# EasyEDA schematic Schematic_EasyEDA_Half Cat GSE Controller_2025-02-08.json
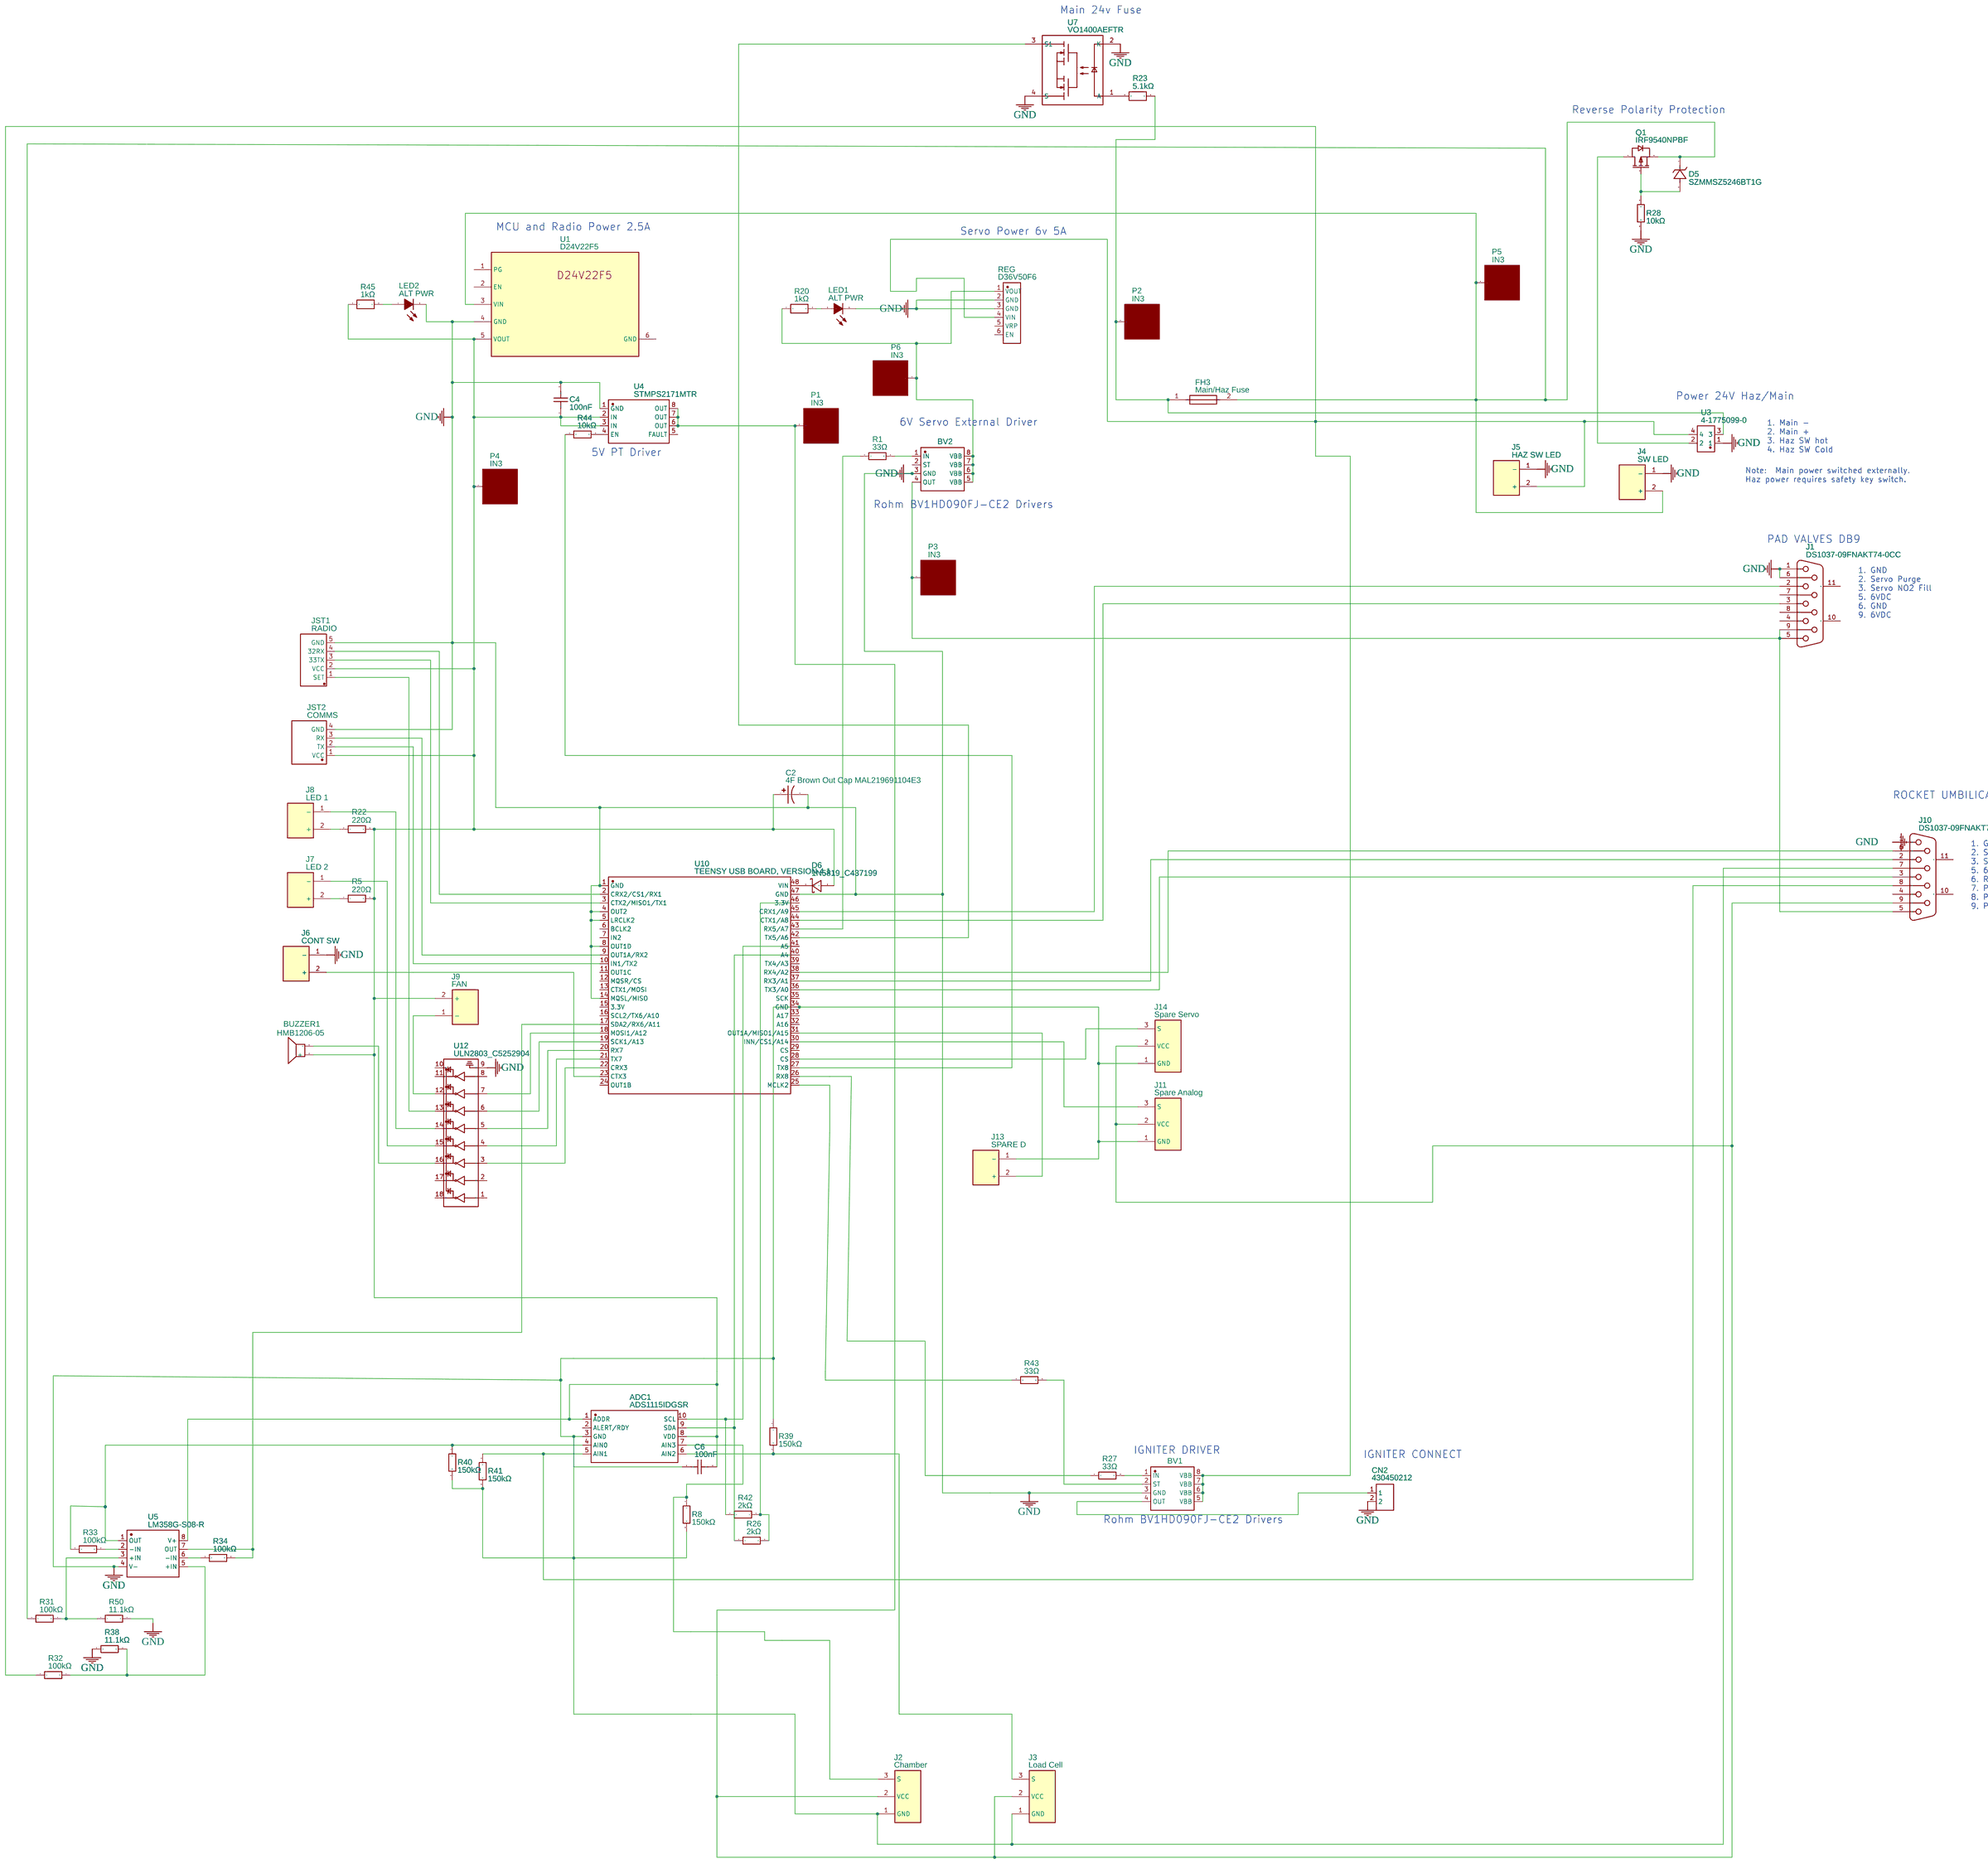
[diagram p0: schematic sheet]

## Parts
ADC1  ADS1115IDGSR  [MSOP-10_L3.0-W3.0-P0.50-LS5.0-BL]
BUZZER1  HMB1206-05  [BUZ-TH_BD12.0-P7.60-D0.6-FD]
BV1  BV2  [SOP-8_L4.9-W3.9-P1.27-LS6.0-BL]
BV2  BV1  [SOP-8_L4.9-W3.9-P1.27-LS6.0-BL]
C2  4F Brown Out Cap MAL219691104E3  [CAP_ROUND_7.5MM]
C4  100nF  [C0402]
C6  100nF  [C0402]
CN2  430450212  [CONN-TH_430450212]
D5  SZMMSZ5246BT1G  [SOD-123_L2.7-W1.6-LS3.7-RD-1]
D6  1N5819_C437199  [SMA_L4.4-W2.6-LS5.0-RD]
FH3  Main/Haz Fuse  [LITTLEFUSE 01000063Z]
J1  DS1037-09FNAKT74-0CC  [DSUB-TH_DS1037-09FNAKT74-0CC]
J2  Chamber  [PH-3A]
J3  Load Cell  [PH-3A]
J4  SW LED  [CONN-TH_B2B-PH-K-S]
J5  HAZ SW LED  [CONN-TH_B2B-PH-K-S]
J6  CONT SW  [CONN-TH_B2B-PH-K-S]
J7  LED 2  [CONN-TH_B2B-PH-K-S]
J8  LED 1  [CONN-TH_B2B-PH-K-S]
J9  FAN  [CONN-TH_B2B-PH-K-S]
J10  DS1037-09FNAKT74-0CC  [DSUB-TH_DS1037-09FNAKT74-0CC]
J11  Spare Analog  [PH-3A]
J13  SPARE D  [CONN-TH_B2B-PH-K-S]
J14  Spare Servo  [PH-3A]
JST1  RADIO  [CONN-TH_B5B-PH-K-S-LF-SN]
JST2  COMMS  [CONN-TH_B4B-PH-K-LF-SN]
LED1  ALT PWR  [LED-SMD_L3.5-W2.8-R-RD]
LED2  ALT PWR  [LED-SMD_L3.5-W2.8-R-RD]
P1  IN3  [PAD_1.5X2.5]
P2  IN3  [PAD_1.5X2.5]
P3  IN3  [PAD_1.5X2.5]
P4  IN3  [PAD_1.5X2.5]
P5  IN3  [PAD_1.5X2.5]
P6  IN3  [PAD_1.5X2.5]
Q1  IRF9540NPBF  [TO-220-3_L10.0-W4.5-P2.54-L]
R1  33Ω  [R0603]
R5  220Ω  [R0805]
R8  150kΩ  [R0805]
R20  1kΩ  [R0805]
R22  220Ω  [R0805]
R23  5.1kΩ  [R0805]
R26  2kΩ  [R0805]
R27  33Ω  [R0603]
R28  10kΩ  [R0805]
R31  100kΩ  [R0805]
R32  100kΩ  [R0805]
R33  100kΩ  [R0805]
R34  100kΩ  [R0805]
R38  11.1kΩ  [R0603]
R39  150kΩ  [R0805]
R40  150kΩ  [R0805]
R41  150kΩ  [R0805]
R42  2kΩ  [R0805]
R43  33Ω  [R0603]
R44  10kΩ  [R0805]
R45  1kΩ  [R0805]
R50  11.1kΩ  [R0603]
REG  D36V50F6  [D36V50F6]
U1  D24V22F5  [D24V22F5]
U3  4-1775099-0  [CONN-TH_4P-P4.20_TE_4-1775099-0]
U4  STMPS2171MTR  [SO-8_L4.9-W3.9-P1.27-LS6.0-BL]
U5  LM358G-S08-R  [SOIC-8_L5.0-W4.0-P1.27-LS6.0-BL]
U7  VO1400AEFTR  [SOP-4_L4.6-W4.4-P2.54-LS7.0-TL]
U10  TEENSY USB BOARD, VERSION 4.1  [COMM-TH_L61.0-W17.8-P2.54]
U12  ULN2803_C5252904  [SOP-18_L11.5-W7.5-P1.27-LS10.3-BL]

## Library data of the parts
ADC1 = ADS1115IDGSR: Supplier: LCSC; Manufacturer: TI(德州仪器); Supplier Part: C37593; JLCPCB Part Class: Extended Part; link: https://lcsc.com/eda_search?q=C37593&%26type=1&ref=editor
BUZZER1 = HMB1206-05: Supplier: LCSC; Manufacturer: HNDZ; Supplier Part: C96095; LCSC Assembly: Yes; SMT Type: Extend; Assembly Type: manualWeld; Paste Type: expand
BV1 BV2 = BV1HD090FJ-CE2: Supplier: LCSC; Supplier Part: C2150182; Manufacturer: ROHM(罗姆); Contributor: LCSC; JLCPCB Part Class: Extended Part
C2 = C_Tan_SMD_A_US: Contributor: LCEDA_Lib
C4 C6 = GRM155B31C104KA87D: Supplier: LCSC; Manufacturer: muRata(村田); Supplier Part: C85951; JLCPCB Part Class: Extended Part; link: https://lcsc.com/eda_search?q=C85951&%26type=1&ref=editor
CN2 = 430450212: Contributor: LCSC; Supplier: LCSC; Supplier Part: C293362; Manufacturer: MOLEX; JLCPCB Part Class: Extended Part; link: https://lcsc.com/eda_search?q=C293362&%26type=1&ref=editor
D5 = SZMMSZ5246BT1G: Contributor: LCSC; Supplier: LCSC; Supplier Part: C513075; Manufacturer: onsemi(安森美); JLCPCB Part Class: Extended Part; link: https://lcsc.com/eda_search?q=C513075&%26type=1&ref=editor
D6 = 1N5819_C437199: Contributor: LCSC; Supplier: LCSC; Supplier Part: C437199; Manufacturer: KEXIN(科信); Manufacturer Part: 1N5819; JLCPCB Part Class: Extended Part; link: https://lcsc.com/eda_search?q=C437199&%26type=1&ref=editor
FH3 = Mini Blade Fuse Holder: Supplier: LCSC; Supplier Part: 01000063Z; Manufacturer: Littlefuse; Manufacturer Part: 01000063Z; Contributor: Bob11746; JLCPCB Part Class: Extended Part
J1 J10 = DS1037-09FNAKT74-0CC: Supplier: LCSC; Manufacturer: CONNFLY; Supplier Part: C75749; JLCPCB Part Class: Extended Part
J2 J3 J11 J14 = -: Supplier: LCSC; Manufacturer: JST; Manufacturer Part: B3B-PH-K-S(LF)(SN); Contributor: LCSC; Supplier Part: C131339
J4-J9 J13 = B2B-PH-K-S(LF)(SN): Supplier: LCSC; Manufacturer: JST; Contributor: LCSC; Supplier Part: C131337
JST1 = B5B-PH-K-S-(LF)(SN): Contributor: LCSC; Supplier: LCSC; Supplier Part: C157993; Manufacturer: JST; Manufacturer Part: B5B-PH-K-S(LF)(SN); JLCPCB Part Class: Extended Part; link: https://lcsc.com/eda_search?q=C157993&%26type=1&ref=editor
JST2 = B4B-PH-K(LF)(SN): Contributor: LCSC; Supplier: LCSC; Supplier Part: C265289; Manufacturer: JST; JLCPCB Part Class: Extended Part; link: https://lcsc.com/eda_search?q=C265289&%26type=1&ref=editor
LED1 LED2 = 67-21/R6C-FN2Q1BZ/2T: Supplier: LCSC; Manufacturer: EVERLIGHT; image: //image.lceda.cn/szlcsc/C74350.jpg; Supplier Part: C74350; SMT Type: Extend; JLCPCB SMD: Yes; LCSC Assembly: Yes; Paste Type: expand
P1-P6 = Solder Pad: Manufacturer Part: Soldering pad; Supplier Part: undefined; Contributor: Michael Gronlund
Q1 = IRF9540NPBF: Supplier: LCSC; Manufacturer: Infineon(英飞凌); Supplier Part: C2575; JLCPCB Part Class: Extended Part; link: https://lcsc.com/eda_search?q=C2575&%26type=1&ref=editor
R1 R27 R43 = RM06FTN33R0: Contributor: LCSC; Supplier: LCSC; Supplier Part: C188015; Manufacturer: 大毅科技; JLCPCB Part Class: Extended Part; link: https://lcsc.com/eda_search?q=C188015&%26type=1&ref=editor
R5 R22 = MCWR08X221-JTL: Contributor: LCSC; Supplier: LCSC; Supplier Part: C243171; Manufacturer: Multicomp; Manufacturer Part: MCWR08X221 JTL; JLCPCB Part Class: Extended Part; link: https://lcsc.com/eda_search?q=C243171&%26type=1&ref=editor
R8 R39-R41 = RK73B2ATTD154J: Contributor: LCSC; Supplier: LCSC; Supplier Part: C276119; Manufacturer: KOA; JLCPCB Part Class: Extended Part; link: https://lcsc.com/eda_search?q=C276119&%26type=1&ref=editor
R20 R45 = TC0550F1001T5J: Contributor: LCSC; Supplier: LCSC; Supplier Part: C517536; Manufacturer: UNI-ROYAL(厚声); JLCPCB Part Class: Extended Part; link: https://lcsc.com/eda_search?q=C517536&%26type=1&ref=editor
R23 = SCR0805F5K1: Contributor: lcsc; Supplier: LCSC; Supplier Part: C3016714; Manufacturer: VO(翔胜); JLCPCB Part Class: Extended Part; link: https://lcsc.com/eda_search?q=C3016714&%26type=1&ref=editor
R26 R42 = RC0805DR-072KL: Contributor: LCSC; Supplier: LCSC; Manufacturer: YAGEO(国巨); Supplier Part: C164147; JLCPCB Part Class: Extended Part; link: https://lcsc.com/eda_search?q=C164147&%26type=1&ref=editor
R28 R44 = HPCR0805F10K0K9: Contributor: LCSC; Supplier: LCSC; Supplier Part: C365230; Manufacturer: RESI(开步睿思); JLCPCB Part Class: Extended Part; link: https://lcsc.com/eda_search?q=C365230&%26type=1&ref=editor
R31-R34 = RM10JTN104: Supplier: LCSC; Manufacturer: 大毅科技; Supplier Part: C153167; JLCPCB Part Class: Extended Part; link: https://lcsc.com/eda_search?q=C153167&%26type=1&ref=editor
R38 R50 = RT0603BRD0711K1L: Contributor: lcsc; Supplier: LCSC; Supplier Part: C5197511; Manufacturer: YAGEO(国巨); JLCPCB Part Class: Extended Part; link: https://lcsc.com/eda_search?q=C5197511&%26type=1&ref=editor
REG = D36V50F6
U1 = D24V22F5: Contributor: winter2015; sourceId: YsmgyP7pj
U3 = 4-1775099-0: Contributor: lcsc; Supplier: LCSC; Supplier Part: C5164039; Manufacturer: TE Connectivity(美国泰科); link: https://lcsc.com/eda_search?q=C5164039&%26type=1&ref=editor
U4 = STMPS2171MTR: Contributor: LCSC; Supplier: LCSC; Supplier Part: C2150330; Manufacturer: ST(意法半导体); JLCPCB Part Class: Extended Part; link: https://lcsc.com/eda_search?q=C2150330&%26type=1&ref=editor
U5 = LM358G-S08-R: Supplier: LCSC; Manufacturer: UTC; Supplier Part: C71101; JLCPCB Part Class: Extended Part
U7 = VO1400AEFTR: Contributor: LCSC; Supplier: LCSC; Manufacturer: VISHAY(威世); Supplier Part: C142551; JLCPCB Part Class: Extended Part; link: https://lcsc.com/eda_search?q=C142551&%26type=1&ref=editor
U10 = TEENSY USB BOARD, VERSION 4.1: Supplier: LCSC; Supplier Part: C9900060513; Manufacturer: null; Manufacturer Part: Teensy USB Board, Version 4.1; Contributor: lcsc; JLCPCB Part Class: Extended Part; link: https://lcsc.com/eda_search?q=C9900060513&%26type=1&ref=editor
U12 = ULN2803_C5252904: Contributor: lcsc; Supplier: LCSC; Supplier Part: C5252904; Manufacturer: MSKSEMI(美森科); Manufacturer Part: ULN2803; JLCPCB Part Class: Extended Part; link: https://lcsc.com/eda_search?q=C5252904&%26type=1&ref=editor

## Nets
GND: ADC1.3(GND) BV1.3(GND) BV2.3(GND) C2.2 C4.2 C6.1 CN2.2 J1.1 J1.6 J2.1(GND) J3.1(GND) J4.1(-) J5.1(-) J6.1(-) J10.1 J10.7 J11.1(GND) J13.1(-) J14.1(GND) JST1.5(GND) JST2.4(GND) LED1.2(C) LED2.2(C) R8.2 R28.2 R38.1 R39.1 R40.2 R41.2 R50.2 REG.2(GND) REG.3(GND) U1.4(GND) U3.1 U4.1(GND) U5.4(V-) U7.2(K) U7.4(S) U10.1(GND) U10.4(OUT2) U10.5(LRCLK2) U10.8(OUT1D) U10.14(MQSL/MISO) U10.34(GND) U10.47(GND) U12.9(GND)
Net-(ADC1-1): ADC1.1(ADDR) ADC1.8(VDD) BUZZER1.1(+) C2.1 C4.1 C6.2 D6.2(A) J9.2(+) JST1.2(VCC) JST2.1(VCC) P4.1 R5.2 R22.2 R45.1 U1.5(VOUT) U4.2(IN) U4.3(IN) U5.8(V+)
Net-(ADC1-4): ADC1.4(AIN0) R33.1 R40.1 U5.1(OUT)
Net-(ADC1-5): ADC1.5(AIN1) J10.8 R41.1
Net-(ADC1-6): ADC1.6(AIN2) J3.3(S) R39.2
Net-(ADC1-7): ADC1.7(AIN3) J2.3(S) R8.1
Net-(ADC1-9): ADC1.9(SDA) R26.1 U10.40(A4)
Net-(ADC1-10): ADC1.10(SCL) R42.1 U10.41(A5)
Net-(BUZZER1-2): BUZZER1.2 U12.16(3OUT)
Net-(BV1-1): BV1.1(IN) R1.2
Net-(BV1-4): BV1.4(OUT) J1.5 J1.9 J10.5 P3.1
Net-(BV1-5): BV1.5(VBB) BV1.6(VBB) BV1.7(VBB) BV1.8(VBB) P6.1 R20.1 REG.1(VOUT)
Net-(BV2-1): BV2.1(IN) R27.2
Net-(BV2-2): BV2.2(ST) R43.2
Net-(BV2-4): BV2.4(OUT) CN2.1
Net-(BV2-5): BV2.5(VBB) BV2.6(VBB) BV2.7(VBB) BV2.8(VBB) J5.2(+) R32.1 REG.4(VIN) U3.4
Net-(D5-1): D5.1(C) FH3.2 J4.2(+) P5.1 Q1.3(S) R31.1 U1.3(VIN)
Net-(D5-2): D5.2(A) Q1.1(G) R28.1
Net-(D6-1): D6.1(C) U10.48(VIN)
Net-(FH3-1): FH3.1 P2.1 R23.2 U3.3
Net-(J1-2): J1.2 U10.45(CRX1/A9)
Net-(J1-3): J1.3 U10.44(CTX1/A8)
Net-(J2-2): J2.2(VCC) J3.2(VCC) J10.9 J11.2(VCC) J14.2(VCC) P1.1 U4.6(OUT) U4.7(OUT) U4.8(OUT)
Net-(J6-2): J6.2(+) U10.23(CTX3)
Net-(J7-1): J7.1(-) U12.15(4OUT)
Net-(J7-2): J7.2(+) R5.1
Net-(J8-1): J8.1(-) U12.14(5OUT)
Net-(J8-2): J8.2(+) R22.1
Net-(J9-1): J9.1(-) U12.12(7OUT)
Net-(J10-2): J10.2 U10.37(RX3/A1)
Net-(J10-3): J10.3 U10.36(TX3/A0)
Net-(J10-6): J10.6 U10.38(RX4/A2)
Net-(J11-3): J11.3(S) U10.30(INN/CS1/A14)
Net-(J13-2): J13.2(+) U10.31(OUT1A/MISO1/A15)
Net-(J14-3): J14.3(S) U10.28(CS)
Net-(JST1-1): JST1.1(SET) U12.13(6OUT)
Net-(JST1-3): JST1.3(33TX) U10.3(CTX2/MISO1/TX1)
Net-(JST1-4): JST1.4(32RX) U10.2(CRX2/CS1/RX1)
Net-(JST2-2): JST2.2(TX) U10.10(IN1/TX2)
Net-(JST2-3): JST2.3(RX) U10.9(OUT1A/RX2)
Net-(LED1-1): LED1.1(A) R20.2
Net-(LED2-1): LED2.1(A) R45.2
Net-(Q1-2): Q1.2(D) U3.2
Net-(R1-1): R1.1 U10.43(RX5/A7)
Net-(R23-1): R23.1 U7.1(A)
Net-(R26-2): R26.2 R42.2 U10.46(3.3V)
Net-(R27-1): R27.1 U10.26(RX8)
Net-(R31-2): R31.2 R50.1 U5.3(+IN)
Net-(R32-2): R32.2 R38.2 U5.5(+IN)
Net-(R33-2): R33.2 U5.2(-IN)
Net-(R34-1): R34.1 U5.6(-IN)
Net-(R34-2): R34.2 U5.7(OUT) U10.17(SDA2/RX6/A11)
Net-(R43-1): R43.1 U10.25(MCLK2)
Net-(R44-1): R44.1 U10.27(TX8)
Net-(R44-2): R44.2 U4.4(EN)
Net-(U7-3): U7.3(S1) U10.42(TX5/A6)
Net-(U10-18): U10.18(MOSI1/A12) U12.7(7IN)
Net-(U10-19): U10.19(SCK1/A13) U12.6(6IN)
Net-(U10-20): U10.20(RX7) U12.5(5IN)
Net-(U10-21): U10.21(TX7) U12.4(4IN)
Net-(U10-22): U10.22(CRX3) U12.3(3IN)

Not connected (* = marked no-connect by the designer): ADC1 2(ALERT/RDY); BV1 2(ST); J1 4 7 8 10(MH1) 11(MH2); J10 4 10(MH1) 11(MH2); REG 5(VRP) 6(EN); U1 1(PG) 2(EN) 6(GND); U4 5(FAULT); U10 6(BCLK2) 7(IN2) 11(OUT1C) 12(MQSR/CS) 13(CTX1/MOSI) 15(3.3V) 16(SCL2/TX6/A10) 24(OUT1B) 29(CS) 32(A16) 33(A17) 35(SCK) 39(TX4/A3); U12 1(1IN) 2(2IN) 8(8IN) 10(COMMON) 11(8OUT) 17(2OUT) 18(1OUT)

## Notes on the sheet
- FUSE STATUS DETECT - OPTO ISOLATED
- Main 24v Fuse
- Reverse Polarity Protection
- MCU and Radio Power 2.5A
- Servo Power 6v 5A
- Power 24V Haz/Main
- 6V Servo External Driver
- 1. Main -
  2. Main +
  3. Haz SW hot
  4. Haz SW Cold
- 5V PT Driver
- Note:  Main power switched externally.
  Haz power requires safety key switch.
- Rohm BV1HD090FJ-CE2 Drivers
- PAD VALVES DB9
- 1. GND
  2. Servo Purge
  3. Servo NO2 Fill
  5. 6VDC
  6. GND
  9. 6VDC
- ROCKET UMBILICAL DB9
- 1. GND
  2. Servo OX
  3. Servo Fuel
  5. 6VDC
  6. Rocket Connect
  7. PT GND
  8. PT Sense
  9. PT 5VDC
- IGNITER DRIVER
- IGNITER CONNECT
- Rohm BV1HD090FJ-CE2 Drivers
